# Altium schematic sheet MainBoard.SchDoc
size A4
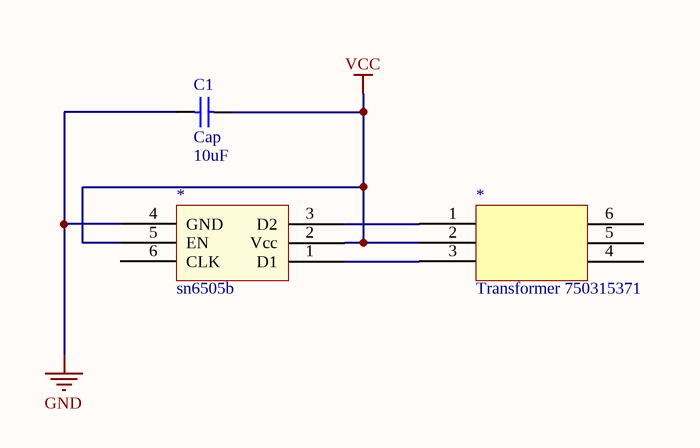
[diagram p0: MainBoard.SchDoc]

## Parts
(Parts that share a designator on the sheet are numbered #1, #2 ... from top to bottom, then left to right.)
*#1  Transformer 750315371  [Transformer 750315371]
*#2  sn6505b  [sn6505b]
C1  Cap  value 10uF  [RAD-0.3]

## Nets
GND: *#2.4(GND) C1.1
VCC: *#1.2 *#2.2(Vcc) *#2.5(EN) C1.2
Net*#1_1: *#1.1 *#2.3(D2)
Net*#1_3: *#1.3 *#2.1(D1)

Not connected (* = marked no-connect by the designer): *#1 4 5 6; *#2 6(CLK)

## Library data of the parts
C1 = Cap: Capacitor; Published: 8-Jun-2000; LatestRevisionDate: 17-Jul-2002; LatestRevisionNote: Re-released for DXP Platform.; PackageReference: RAD-0.3; Publisher: Altium Limited; PackageDescription: Radial Cap, Thru-Hole; 2 Leads; 0.3 in Pin Spacing